# Altium schematic sheet Sterownik.SchDoc
size A4; SheetNumber: 1; SheetTotal: 7
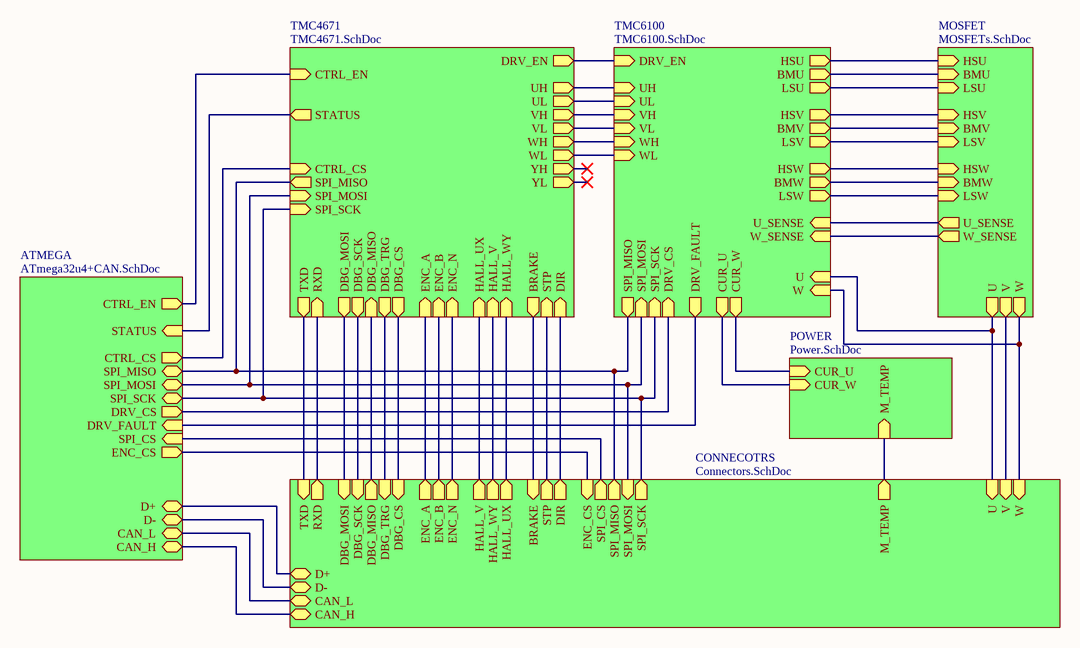
[diagram p0: Sterownik.SchDoc]

## Sub-sheets
ATMEGA = ATmega32u4+CAN.SchDoc: DRV_FAULT (in), SPI_CS (in), STATUS (in), CAN_H (bidir), CAN_L (bidir), D+ (bidir), D- (bidir), SPI_MISO (bidir), SPI_MOSI (bidir), SPI_SCK (bidir), DRV_CS (out), CTRL_CS (out), ENC_CS (out), CTRL_EN (out)
CONNECOTRS = Connectors.SchDoc: M_TEMP (out), ENC_A (out), ENC_B (out), HALL_UX (out), HALL_V (out), HALL_WY (out), SPI_MISO (out), SPI_MOSI (in), SPI_SCK (out), SPI_CS (out), DBG_TRG (in), DBG_MISO (out), DBG_MOSI (in), DBG_SCK (in), DBG_CS (in), U (in), V (in), W (in), CAN_L (bidir), CAN_H (bidir), ENC_N (out), RXD (out), TXD (in), ENC_CS (in), D- (bidir), D+ (bidir), DIR (out), STP (out), BRAKE (in)
MOSFET = MOSFETs.SchDoc: U (out), U_SENSE (out), V (out), W (out), W_SENSE (out), BMU (in), BMV (in), BMW (in), HSU (in), HSV (in), HSW (in), LSU (in), LSV (in), LSW (in)
POWER = Power.SchDoc: CUR_W (in), CUR_U (in), M_TEMP (in)
TMC4671 = TMC4671.SchDoc: CTRL_CS (in), CTRL_EN (in), DBG_MISO (in), ENC_A (in), ENC_B (in), ENC_N (in), HALL_UX (in), HALL_V (in), HALL_WY (in), RXD (in), SPI_MOSI (in), SPI_SCK (in), BRAKE (out), DBG_CS (out), DBG_MOSI (out), DBG_SCK (out), DBG_TRG (out), DRV_EN (out), SPI_MISO (out), STATUS (out), TXD (out), UH (out), UL (out), VH (out), VL (out), WH (out), WL (out), YH (out), YL (out), STP (in), DIR (in)
TMC6100 = TMC6100.SchDoc: DRV_CS (in), DRV_EN (in), SPI_MOSI (in), SPI_SCK (in), U (in), UH (in), UL (in), U_SENSE (in), VH (in), VL (in), W (in), WH (in), WL (in), W_SENSE (in), BMU (out), BMV (out), BMW (out), CUR_U (out), CUR_W (out), DRV_FAULT (out), HSU (out), HSV (out), HSW (out), LSU (out), LSV (out), LSW (out), SPI_MISO (out)

## Nets
(unnamed): sheet TMC4671/CTRL_CS, sheet ATMEGA/CTRL_CS
(unnamed): sheet TMC4671/CTRL_EN, sheet ATMEGA/CTRL_EN
(unnamed): sheet TMC4671/DBG_MISO, sheet CONNECOTRS/DBG_MISO
(unnamed): sheet TMC4671/ENC_A, sheet CONNECOTRS/ENC_A
(unnamed): sheet TMC4671/ENC_B, sheet CONNECOTRS/ENC_B
(unnamed): sheet TMC4671/ENC_N, sheet CONNECOTRS/ENC_N
(unnamed): sheet TMC4671/HALL_UX, sheet CONNECOTRS/HALL_V
(unnamed): sheet TMC4671/HALL_V, sheet CONNECOTRS/HALL_WY
(unnamed): sheet TMC4671/HALL_WY, sheet CONNECOTRS/HALL_UX
(unnamed): sheet TMC4671/RXD, sheet CONNECOTRS/RXD
(unnamed): sheet TMC4671/SPI_MOSI, sheet TMC6100/SPI_MOSI, sheet CONNECOTRS/SPI_MOSI, sheet ATMEGA/SPI_MOSI
(unnamed): sheet TMC4671/SPI_SCK, sheet TMC6100/SPI_SCK, sheet CONNECOTRS/SPI_SCK, sheet ATMEGA/SPI_SCK
(unnamed): sheet TMC4671/BRAKE, sheet CONNECOTRS/BRAKE
(unnamed): sheet TMC4671/DBG_CS, sheet CONNECOTRS/DBG_CS
(unnamed): sheet TMC4671/DBG_MOSI, sheet CONNECOTRS/DBG_MOSI
(unnamed): sheet TMC4671/DBG_SCK, sheet CONNECOTRS/DBG_SCK
(unnamed): sheet TMC4671/DBG_TRG, sheet CONNECOTRS/DBG_TRG
(unnamed): sheet TMC4671/DRV_EN, sheet TMC6100/DRV_EN
(unnamed): sheet TMC4671/SPI_MISO, sheet TMC6100/SPI_MISO, sheet CONNECOTRS/SPI_MISO, sheet ATMEGA/SPI_MISO
(unnamed): sheet TMC4671/STATUS, sheet ATMEGA/STATUS
(unnamed): sheet TMC4671/TXD, sheet CONNECOTRS/TXD
(unnamed): sheet TMC4671/UH, sheet TMC6100/UH
(unnamed): sheet TMC4671/UL, sheet TMC6100/UL
(unnamed): sheet TMC4671/VH, sheet TMC6100/VH
(unnamed): sheet TMC4671/VL, sheet TMC6100/VL
(unnamed): sheet TMC4671/WH, sheet TMC6100/WH
(unnamed): sheet TMC4671/WL, sheet TMC6100/WL
(unnamed): sheet TMC4671/STP, sheet CONNECOTRS/STP
(unnamed): sheet TMC4671/DIR, sheet CONNECOTRS/DIR
(unnamed): sheet TMC6100/DRV_CS, sheet ATMEGA/DRV_CS
(unnamed): sheet TMC6100/U, sheet CONNECOTRS/U, sheet MOSFET/U
(unnamed): sheet TMC6100/U_SENSE, sheet MOSFET/U_SENSE
(unnamed): sheet TMC6100/W, sheet CONNECOTRS/W, sheet MOSFET/W
(unnamed): sheet TMC6100/W_SENSE, sheet MOSFET/W_SENSE
(unnamed): sheet TMC6100/BMU, sheet MOSFET/BMU
(unnamed): sheet TMC6100/BMV, sheet MOSFET/BMV
(unnamed): sheet TMC6100/BMW, sheet MOSFET/BMW
(unnamed): sheet TMC6100/CUR_U, sheet POWER/CUR_W
(unnamed): sheet TMC6100/CUR_W, sheet POWER/CUR_U
(unnamed): sheet TMC6100/DRV_FAULT, sheet ATMEGA/DRV_FAULT
(unnamed): sheet TMC6100/HSU, sheet MOSFET/HSU
(unnamed): sheet TMC6100/HSV, sheet MOSFET/HSV
(unnamed): sheet TMC6100/HSW, sheet MOSFET/HSW
(unnamed): sheet TMC6100/LSU, sheet MOSFET/LSU
(unnamed): sheet TMC6100/LSV, sheet MOSFET/LSV
(unnamed): sheet TMC6100/LSW, sheet MOSFET/LSW
(unnamed): sheet POWER/M_TEMP, sheet CONNECOTRS/M_TEMP
(unnamed): sheet CONNECOTRS/SPI_CS, sheet ATMEGA/SPI_CS
(unnamed): sheet CONNECOTRS/V, sheet MOSFET/V
(unnamed): sheet CONNECOTRS/CAN_L, sheet ATMEGA/CAN_L
(unnamed): sheet CONNECOTRS/CAN_H, sheet ATMEGA/CAN_H
(unnamed): sheet CONNECOTRS/ENC_CS, sheet ATMEGA/ENC_CS
(unnamed): sheet CONNECOTRS/D-, sheet ATMEGA/D-
(unnamed): sheet CONNECOTRS/D+, sheet ATMEGA/D+